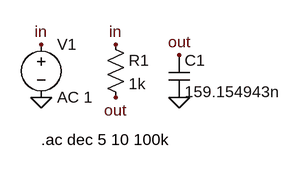
[diagram p0: schematic rc_ac.asc]
rc_ac.asc, the LTspice schematic file:
Version 4
SHEET 1 880 680
FLAG 0 16 in
FLAG 0 96 0
FLAG 112 16 in
FLAG 112 96 out
FLAG 208 32 out
FLAG 208 96 0
SYMBOL voltage 0 0 R0
SYMATTR InstName V1
SYMATTR Value AC 1
SYMBOL res 96 0 R0
SYMATTR InstName R1
SYMATTR Value 1k
SYMBOL cap 192 32 R0
SYMATTR InstName C1
SYMATTR Value 159.154943n
TEXT 0 160 Left 2 !.ac dec 5 10 100k

The netlist it stands for:
* rc_ac.asc
V1 in 0 AC 1
R1 in out 1k
C1 out 0 159.154943n
.ac dec 5 10 100k
.backanno
.end